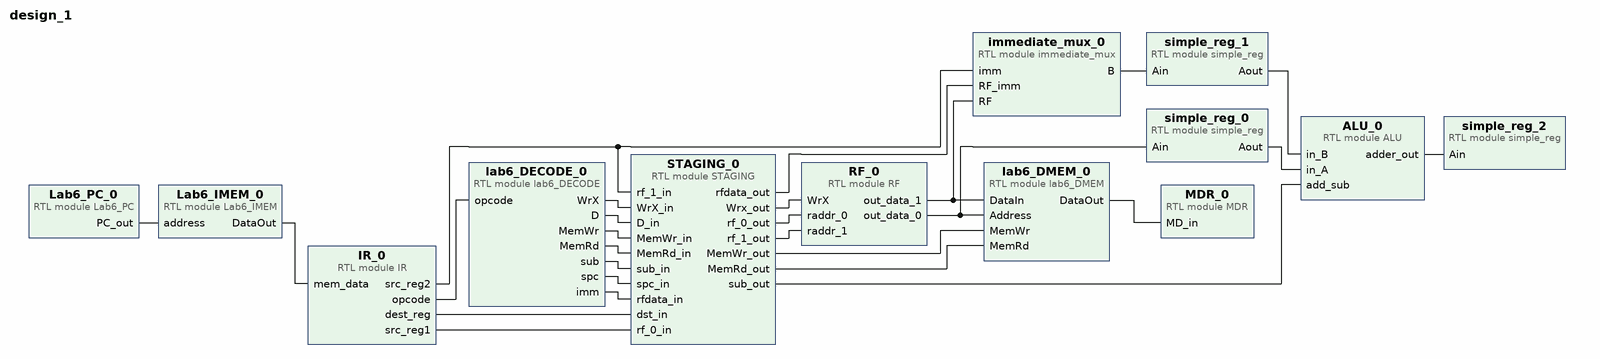
[diagram p0: block diagram of the top level]
# Vivado block design design_1, xc7a100tcsg324-2, Vivado 2019.1
create_bd_design design_1

create_bd_cell -type module -reference IR IR_0
create_bd_cell -type module -reference simple_reg simple_reg_0
create_bd_cell -type module -reference RF RF_0
create_bd_cell -type module -reference simple_reg simple_reg_1
create_bd_cell -type module -reference ALU ALU_0
create_bd_cell -type module -reference immediate_mux immediate_mux_0
create_bd_cell -type module -reference simple_reg simple_reg_2
create_bd_cell -type module -reference MDR MDR_0
create_bd_cell -type module -reference Lab6_PC Lab6_PC_0
create_bd_cell -type module -reference lab6_DMEM lab6_DMEM_0
create_bd_cell -type module -reference lab6_DECODE lab6_DECODE_0
create_bd_cell -type module -reference Lab6_IMEM Lab6_IMEM_0
create_bd_cell -type module -reference STAGING STAGING_0

# ---- connections ----

connect_bd_net [get_bd_pins Lab6_PC_0/PC_out] [get_bd_pins Lab6_IMEM_0/address]
connect_bd_net [get_bd_pins Lab6_IMEM_0/DataOut] [get_bd_pins IR_0/mem_data]
connect_bd_net [get_bd_pins simple_reg_1/Aout] [get_bd_pins ALU_0/in_B]
connect_bd_net [get_bd_pins simple_reg_0/Aout] [get_bd_pins ALU_0/in_A]
connect_bd_net [get_bd_pins immediate_mux_0/B] [get_bd_pins simple_reg_1/Ain]
connect_bd_net [get_bd_pins RF_0/out_data_0] [get_bd_pins simple_reg_0/Ain] [get_bd_pins lab6_DMEM_0/Address]
connect_bd_net [get_bd_pins RF_0/out_data_1] [get_bd_pins immediate_mux_0/RF] [get_bd_pins lab6_DMEM_0/DataIn]
connect_bd_net [get_bd_pins IR_0/src_reg2] [get_bd_pins immediate_mux_0/imm] [get_bd_pins STAGING_0/rf_1_in]
connect_bd_net [get_bd_pins ALU_0/adder_out] [get_bd_pins simple_reg_2/Ain]
connect_bd_net [get_bd_pins lab6_DMEM_0/DataOut] [get_bd_pins MDR_0/MD_in]
connect_bd_net [get_bd_pins IR_0/opcode] [get_bd_pins lab6_DECODE_0/opcode]
connect_bd_net [get_bd_pins lab6_DECODE_0/WrX] [get_bd_pins STAGING_0/WrX_in]
connect_bd_net [get_bd_pins lab6_DECODE_0/D] [get_bd_pins STAGING_0/D_in]
connect_bd_net [get_bd_pins lab6_DECODE_0/MemWr] [get_bd_pins STAGING_0/MemWr_in]
connect_bd_net [get_bd_pins lab6_DECODE_0/MemRd] [get_bd_pins STAGING_0/MemRd_in]
connect_bd_net [get_bd_pins lab6_DECODE_0/sub] [get_bd_pins STAGING_0/sub_in]
connect_bd_net [get_bd_pins IR_0/dest_reg] [get_bd_pins STAGING_0/dst_in]
connect_bd_net [get_bd_pins IR_0/src_reg1] [get_bd_pins STAGING_0/rf_0_in]
connect_bd_net [get_bd_pins lab6_DECODE_0/spc] [get_bd_pins STAGING_0/spc_in]
connect_bd_net [get_bd_pins STAGING_0/Wrx_out] [get_bd_pins RF_0/WrX]
connect_bd_net [get_bd_pins STAGING_0/sub_out] [get_bd_pins ALU_0/add_sub]
connect_bd_net [get_bd_pins STAGING_0/rf_0_out] [get_bd_pins RF_0/raddr_0]
connect_bd_net [get_bd_pins STAGING_0/rf_1_out] [get_bd_pins RF_0/raddr_1]
connect_bd_net [get_bd_pins lab6_DECODE_0/imm] [get_bd_pins STAGING_0/rfdata_in]
connect_bd_net [get_bd_pins STAGING_0/rfdata_out] [get_bd_pins immediate_mux_0/RF_imm]
connect_bd_net [get_bd_pins STAGING_0/MemWr_out] [get_bd_pins lab6_DMEM_0/MemWr]
connect_bd_net [get_bd_pins STAGING_0/MemRd_out] [get_bd_pins lab6_DMEM_0/MemRd]

validate_bd_design
save_bd_design
